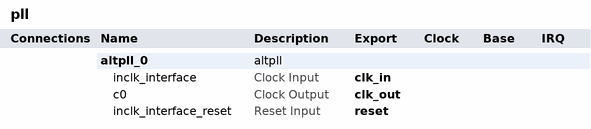
[diagram p0: system contents]
# Platform Designer (Qsys) system pll, Cyclone II AUTO
# Parameters at their usual value, and those the tool derives, are not listed.
package require qsys
create_system pll
set_project_property DEVICE_FAMILY {Cyclone II}
set_project_property DEVICE AUTO

add_instance altpll_0 altpll 12.0
set_instance_parameter_value altpll_0 INCLK0_INPUT_FREQUENCY 41666
set_instance_parameter_value altpll_0 GATE_LOCK_SIGNAL NO
set_instance_parameter_value altpll_0 VALID_LOCK_MULTIPLIER 1
set_instance_parameter_value altpll_0 INVALID_LOCK_MULTIPLIER 5
set_instance_parameter_value altpll_0 CLK0_MULTIPLY_BY 9
set_instance_parameter_value altpll_0 CLK0_DIVIDE_BY 2
set_instance_parameter_value altpll_0 PORT_clk1 PORT_UNUSED
set_instance_parameter_value altpll_0 PORT_clk2 PORT_UNUSED
set_instance_parameter_value altpll_0 PORT_clk3 PORT_UNUSED
set_instance_parameter_value altpll_0 PORT_ARESET PORT_UNUSED
set_instance_parameter_value altpll_0 PORT_LOCKED PORT_UNUSED

# exported interfaces
add_interface clk_in clock sink
set_interface_property clk_in EXPORT_OF altpll_0.inclk_interface
add_interface reset reset sink
set_interface_property reset EXPORT_OF altpll_0.inclk_interface_reset
add_interface clk_out clock source
set_interface_property clk_out EXPORT_OF altpll_0.c0

save_system pll.qsys
